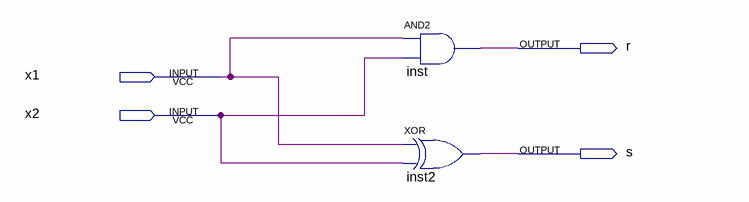
[diagram p0: schematic sheet]
// Quartus schematic adicionaire1.bdf as structural Verilog: 2 symbols, 4 pins
module adicionaire1 (
  input  x1,
  input  x2,
  output r,
  output s
);

  and inst (r, x1, x2);
  xor inst2 (s, x1, x2);
endmodule
